# EAGLE schematic DumbBadgeFusion (EAGLE 9.6.2)

## Sheet 1 of 3: Microcontroller
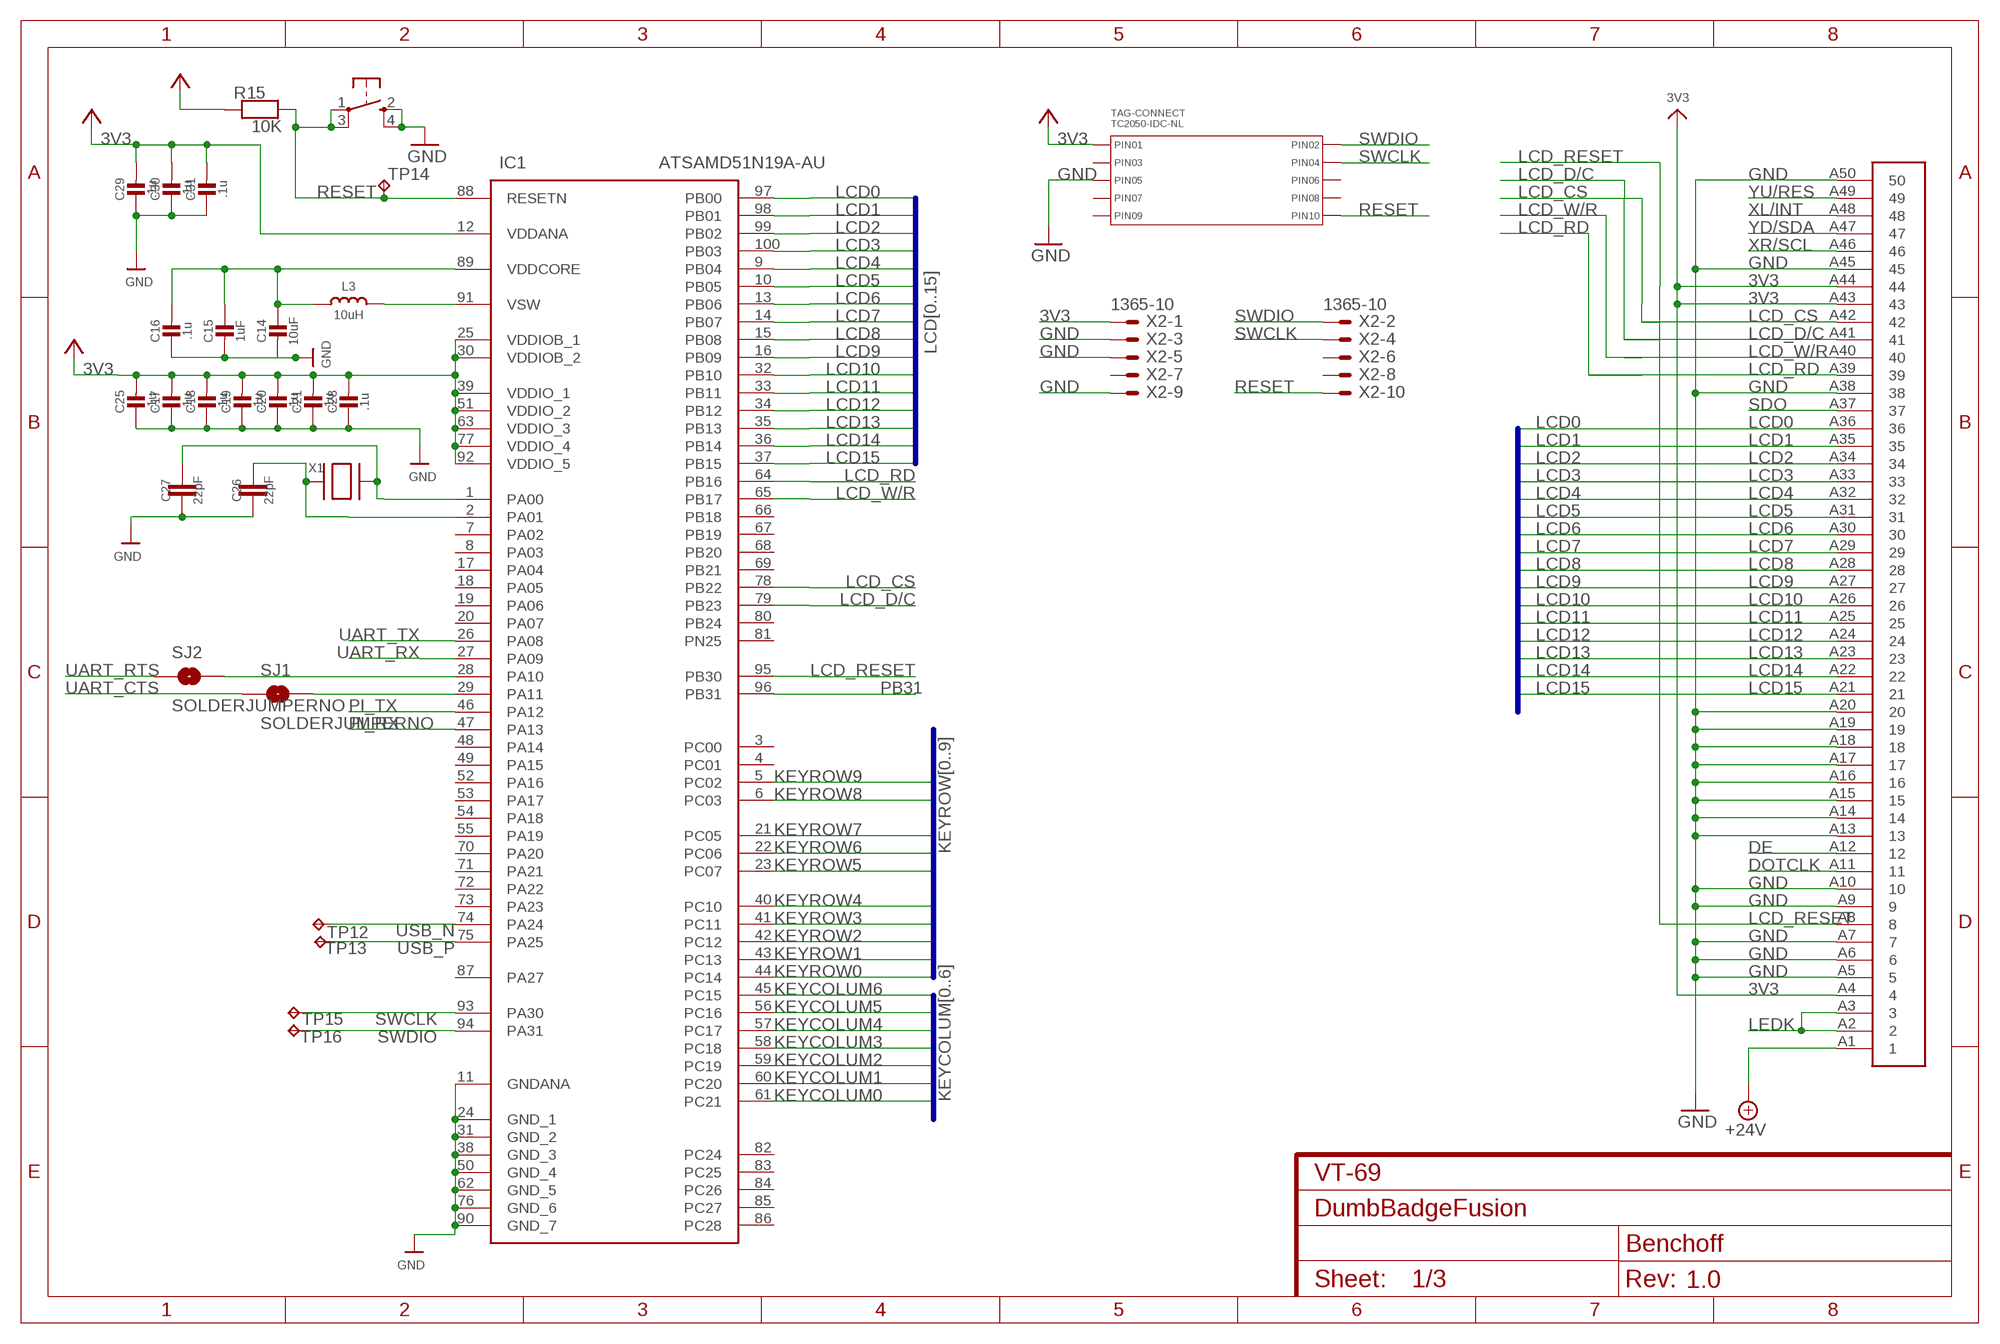
[diagram p0: schematic, sheet 1]
FRAME4 (FRAME-A4L): CNAME: VT-69; CREVISION: 1.0; DESIGNER: Benchoff

### Parts
C14  10uF  CAP_CERAMIC0805-NOOUTLINE  [0805-NO]
C15  1uF  CAP_CERAMIC0603_NO  [0603-NO]
C16  .1u  CAP_CERAMIC0603_NO  [0603-NO]
C17  .1u  CAP_CERAMIC0603_NO  [0603-NO]
C18  .1u  CAP_CERAMIC0603_NO  [0603-NO]
C19  .1u  CAP_CERAMIC0603_NO  [0603-NO]
C20  .1u  CAP_CERAMIC0603_NO  [0603-NO]
C21  .1u  CAP_CERAMIC0603_NO  [0603-NO]
C25  .1u  CAP_CERAMIC0603_NO  [0603-NO]
C26  22pF  1.0UF-0805-25V-10%  [0805]
C27  22pF  1.0UF-0805-25V-10%  [0805]
C28  .1u  CAP_CERAMIC0603_NO  [0603-NO]
C29  .1u  CAP_CERAMIC0603_NO  [0603-NO]
C30  .1u  CAP_CERAMIC0603_NO  [0603-NO]
C31  .1u  CAP_CERAMIC0603_NO  [0603-NO]
FPC50CONN  50PINFPC  [62684-501100ALF]
IC1  ATSAMD51N19A-AU  [QFP50P1600X1600X120-100N]
L3  10uH  INDUCTOR  [INDUCTOR_1007]
R15  10K  RESISTOR_0603_NOOUT  [0603-NO]
SJ1  SOLDERJUMPERNO  [SJ_2S-NO]
SJ2  SOLDERJUMPERNO  [SJ_2S-NO]
SW1  SPST_TACT-KMR2  [KMR2]
TAG-CONNECT  TC2050-IDC-NL  CON_02X05_TC2050-IDC-NL  [TC2050-IDC-NL]
TP12  TPB1,27  [B1,27]
TP13  TPB1,27  [B1,27]
TP14  TPB1,27  [B1,27]
TP15  TPB1,27  [B1,27]
TP16  TPB1,27  [B1,27]
X1  NX3215SA-32.768K-STD-MUA-8  XTAL-3.2X1.5  [XTAL3215]
X2  1365-10  [1365-10]

### Nets
3V3: C17.2 C18.2 C19.2 C20.2 C21.2 C25.2 C28.2 C29.2 C30.2 C31.2 FPC50CONN.A4 FPC50CONN.A43 FPC50CONN.A44 IC1.12(VDDANA) IC1.25(VDDIOB_1) IC1.30(VDDIOB_2) IC1.39(VDDIO_1) IC1.51(VDDIO_2) IC1.63(VDDIO_3) IC1.77(VDDIO_4) IC1.92(VDDIO_5) R15.1 TAG-CONNECT.P$1(PIN1) X2.1 ; supply symbol labelled +3V3 ; also sheet 2,3
+24V: FPC50CONN.A1 ; also sheet 2
DE: FPC50CONN.A12
DOTCLK: FPC50CONN.A11
GND: C14.2 C15.2 C16.1 C17.1 C18.1 C19.1 C20.1 C21.1 C25.1 C26.1 C27.1 C28.1 C29.1 C30.1 C31.1 FPC50CONN.A5 FPC50CONN.A6 FPC50CONN.A7 FPC50CONN.A9 FPC50CONN.A10 FPC50CONN.A13 FPC50CONN.A14 FPC50CONN.A15 FPC50CONN.A16 FPC50CONN.A17 FPC50CONN.A18 FPC50CONN.A19 FPC50CONN.A20 FPC50CONN.A38 FPC50CONN.A45 FPC50CONN.A50 IC1.11(GNDANA) IC1.24(GND_1) IC1.31(GND_2) IC1.38(GND_3) IC1.50(GND_4) IC1.62(GND_5) IC1.76(GND_6) IC1.90(GND_7) SW1.2(S) SW1.4(S1) TAG-CONNECT.P$5(PIN5) X2.3 X2.5 X2.9 ; also sheet 2,3
KEYCOLUM0: IC1.61(PC21) ; also sheet 3
KEYCOLUM1: IC1.60(PC20) ; also sheet 3
KEYCOLUM2: IC1.59(PC19) ; also sheet 3
KEYCOLUM3: IC1.58(PC18) ; also sheet 3
KEYCOLUM4: IC1.57(PC17) ; also sheet 3
KEYCOLUM5: IC1.56(PC16) ; also sheet 3
KEYCOLUM6: IC1.45(PC15) ; also sheet 3
KEYROW0: IC1.44(PC14) ; also sheet 3
KEYROW1: IC1.43(PC13) ; also sheet 3
KEYROW2: IC1.42(PC12) ; also sheet 3
KEYROW3: IC1.41(PC11) ; also sheet 3
KEYROW4: IC1.40(PC10) ; also sheet 3
KEYROW5: IC1.23(PC07) ; also sheet 3
KEYROW6: IC1.22(PC06) ; also sheet 3
KEYROW7: IC1.21(PC05) ; also sheet 3
KEYROW8: IC1.6(PC03) ; also sheet 3
KEYROW9: IC1.5(PC02) ; also sheet 3
LCD0: FPC50CONN.A36 IC1.97(PB00)
LCD1: FPC50CONN.A35 IC1.98(PB01)
LCD2: FPC50CONN.A34 IC1.99(PB02)
LCD3: FPC50CONN.A33 IC1.100(PB03)
LCD4: FPC50CONN.A32 IC1.9(PB04)
LCD5: FPC50CONN.A31 IC1.10(PB05)
LCD6: FPC50CONN.A30 IC1.13(PB06)
LCD7: FPC50CONN.A29 IC1.14(PB07)
LCD8: FPC50CONN.A28 IC1.15(PB08)
LCD9: FPC50CONN.A27 IC1.16(PB09)
LCD10: FPC50CONN.A26 IC1.32(PB10)
LCD11: FPC50CONN.A25 IC1.33(PB11)
LCD12: FPC50CONN.A24 IC1.34(PB12)
LCD13: FPC50CONN.A23 IC1.35(PB13)
LCD14: FPC50CONN.A22 IC1.36(PB14)
LCD15: FPC50CONN.A21 IC1.37(PB15)
LCD_CS: FPC50CONN.A42 IC1.78(PB22)
LCD_D/C: FPC50CONN.A41 IC1.79(PB23)
LCD_RD: FPC50CONN.A39 IC1.64(PB16)
LCD_RESET: FPC50CONN.A8 IC1.95(PB30)
LCD_W/R: FPC50CONN.A40 IC1.65(PB17)
LEDK: FPC50CONN.A2 FPC50CONN.A3 ; also sheet 2
N$23: IC1.28(PA10) SJ2.2
N$26: C14.1 C15.1 C16.2 IC1.89(VDDCORE) L3.P$1
N$27: IC1.91(VSW) L3.P$2
N$28: IC1.29(PA11) SJ1.2
N$54: C27.2 IC1.1(PA00) X1.P$1
N$55: C26.2 IC1.2(PA01) X1.P$2
PB31: IC1.96(PB31) ; also sheet 3
PI_RX: IC1.47(PA13) ; also sheet 3
PI_TX: IC1.46(PA12) ; also sheet 3
RESET: IC1.88(RESETN) R15.2 SW1.1(P) SW1.3(P1) TAG-CONNECT.P$10(PIN10) TP14.TP X2.10
SDO: FPC50CONN.A37
SWCLK: IC1.93(PA30) TAG-CONNECT.P$4(PIN4) TP15.TP X2.4
SWDIO: IC1.94(PA31) TAG-CONNECT.P$2(PIN2) TP16.TP X2.2
UART_CTS: SJ1.1 ; also sheet 3
UART_RTS: SJ2.1 ; also sheet 3
UART_RX: IC1.27(PA09) ; also sheet 3
UART_TX: IC1.26(PA08) ; also sheet 3
USB_N: IC1.74(PA24) TP12.TP ; also sheet 2
USB_P: IC1.75(PA25) TP13.TP ; also sheet 2
XL/INT: FPC50CONN.A48
XR/SCL: FPC50CONN.A46
YD/SDA: FPC50CONN.A47
YU/RES: FPC50CONN.A49
Unconnected: IC1.3(PC00) IC1.4(PC01) IC1.7(PA02) IC1.8(PA03) IC1.17(PA04) IC1.18(PA05) IC1.19(PA06) IC1.20(PA07) IC1.48(PA14) IC1.49(PA15) IC1.52(PA16) IC1.53(PA17) IC1.54(PA18) IC1.55(PA19) IC1.66(PB18) IC1.67(PB19) IC1.68(PB20) IC1.69(PB21) IC1.70(PA20) IC1.71(PA21) IC1.72(PA22) IC1.73(PA23) IC1.80(PB24) IC1.81(PN25) IC1.82(PC24) IC1.83(PC25) IC1.84(PC26) IC1.85(PC27) IC1.86(PC28) IC1.87(PA27) TAG-CONNECT.P$3(PIN3) TAG-CONNECT.P$6(PIN6) TAG-CONNECT.P$7(PIN7) TAG-CONNECT.P$8(PIN8) TAG-CONNECT.P$9(PIN9) X2.6 X2.7 X2.8

### Buses
LCD[0..15]
KEYCOLUM[0..6]
KEYROW[0..9]

## Sheet 2 of 3: Power System I
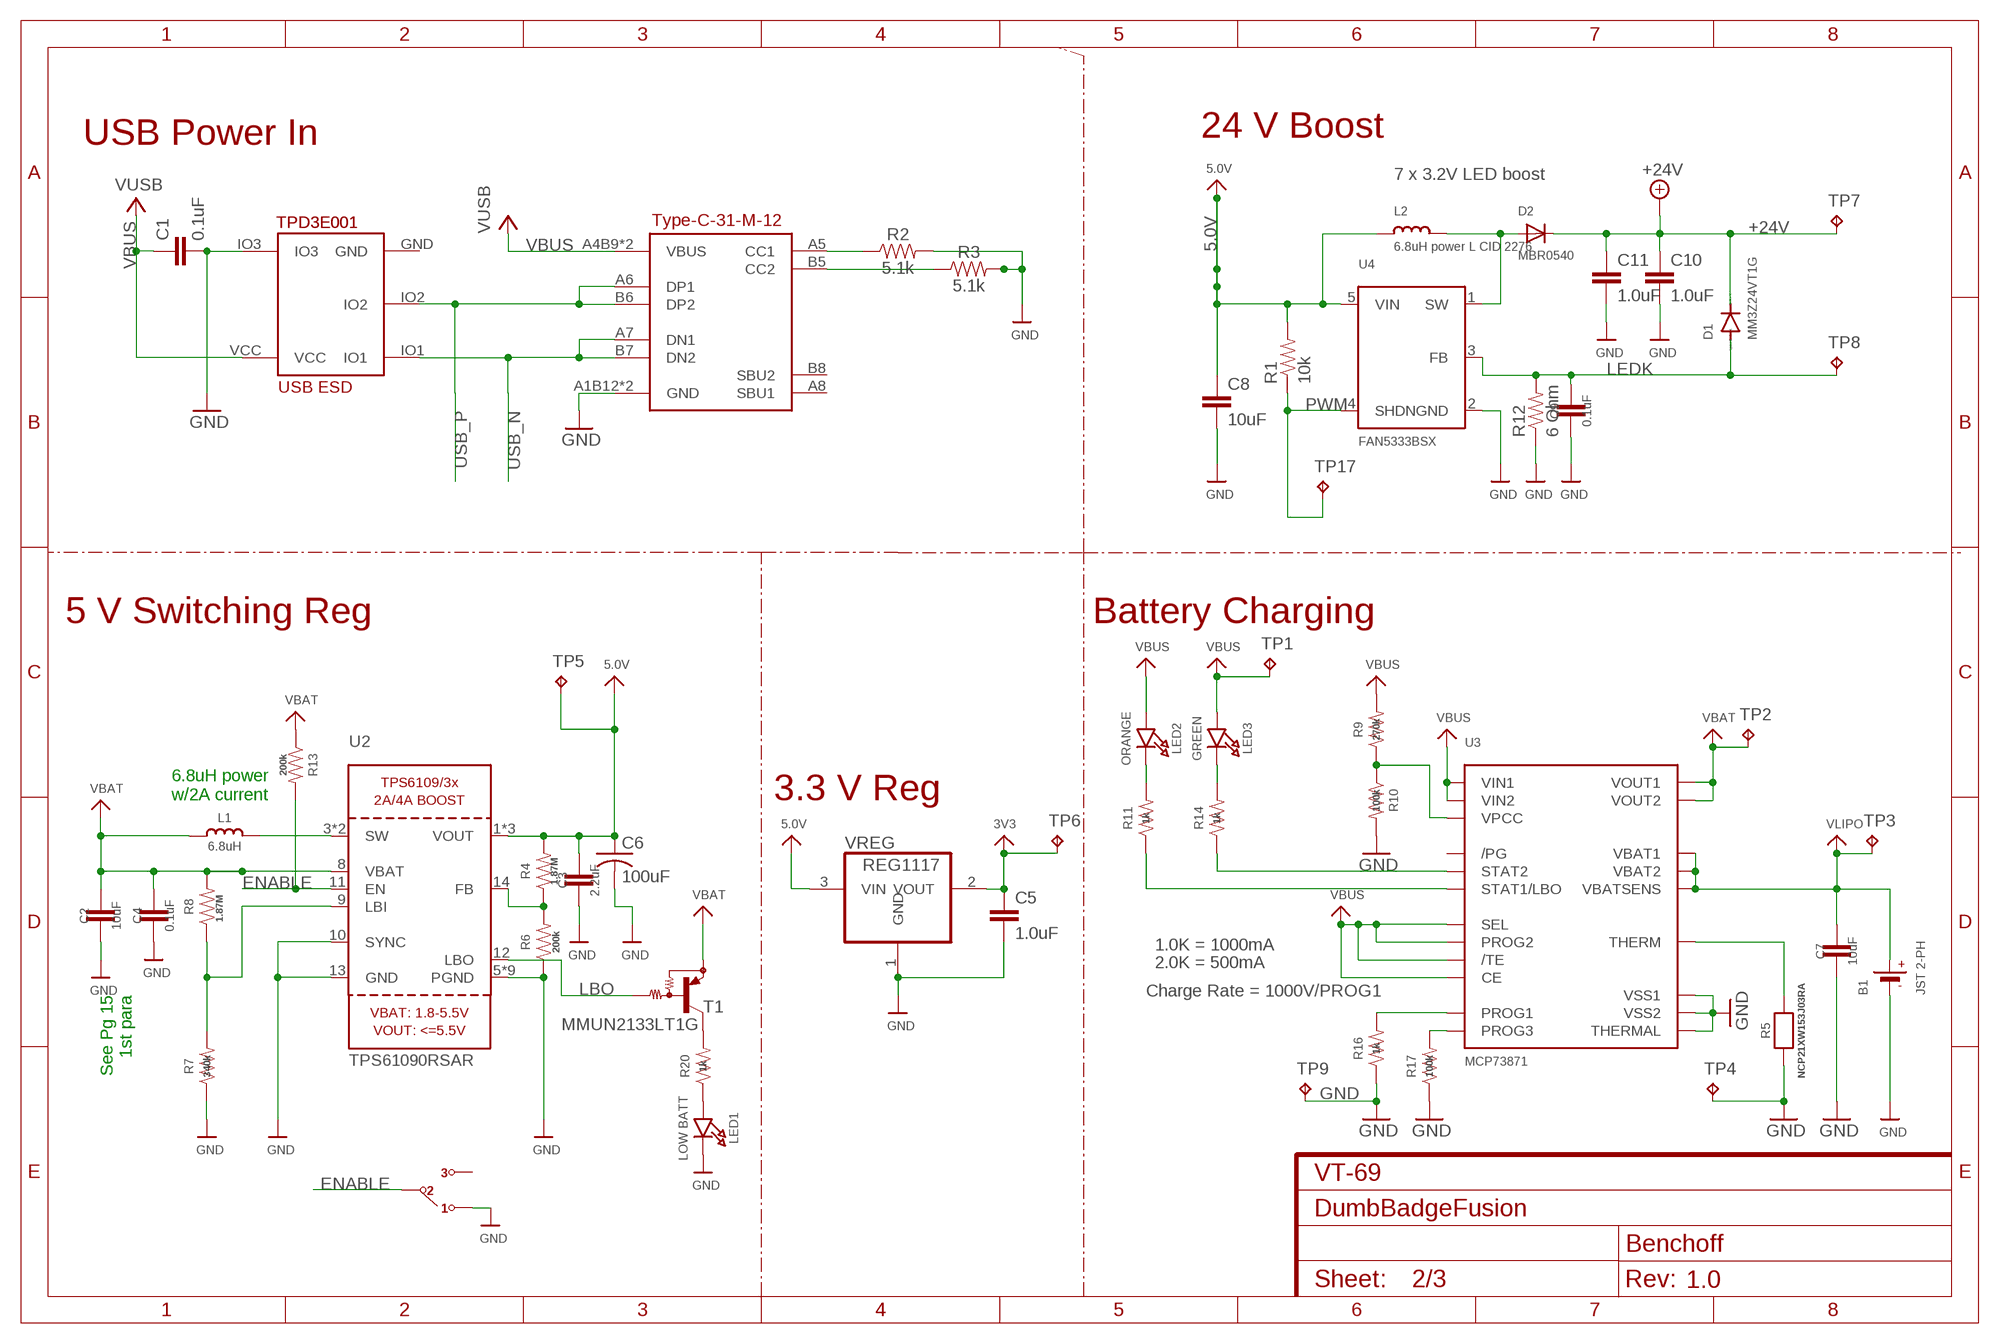
[diagram p1: schematic, sheet 2]
FRAME1 (FRAME-A4L): CNAME: VT-69; CREVISION: 1.0; DESIGNER: Benchoff

### Parts
B1  JST 2-PH  BATTERY  [JSTPH2]
C1  0.1uF  1.0UF-0805-25V-10%  [0805]
C2  10uF  1.0UF-0805-25V-10%  [0805]
C3  2.2uF  1.0UF-0805-25V-10%  [0805]
C4  0.1uF  1.0UF-0805-25V-10%  [0805]
C5  1.0uF  1.0UF-0805-25V-10%  [0805]
C6  100uF  C-USC1210  [C1210]
C7  10uF  1.0UF-0805-25V-10%  [0805]
C8  10uF  1.0UF-0805-25V-10%  [0805]
C9  0.1uF  1.0UF-0805-25V-10%  [0805]
C10  1.0uF  1.0UF-0805-25V-10%  [0805]
C11  1.0uF  1.0UF-0805-25V-10%  [0805]
D1  MM3Z24VT1G  DIODE-SOD323-W  [SOD323-W]
D2  MBR0540  DIODESOD-123  [SOD-123]
L1  6.8uH  INDUCTORTDK_VLC5045  [INDUCTOR_5X5MM_TDK_VLC5045]
L2  6.8uH power L CID 2276  INDUCTORNR5040  [INDUCTOR_5X5MM_NR5040_NOTHERMALS]
LED1  LOW BATT  LED0805_NOOUTLINE  [CHIPLED_0805_NOOUTLINE]
LED2  ORANGE  LED0805_NOOUTLINE  [CHIPLED_0805_NOOUTLINE]
LED3  GREEN  LED0805_NOOUTLINE  [CHIPLED_0805_NOOUTLINE]
R1  10k  1KOHM-0603-1/10W-1%  [0603]
R2  5.1k  1KOHM-0603-1/10W-1%  [0603]
R3  5.1k  1KOHM-0603-1/10W-1%  [0603]
R4  1.87M  1KOHM-0603-1/10W-1%  [0603]
R5  NCP21XW153J03RA  RESISTOR0805_NOOUTLINE  [0805-NO]
R6  200k  1KOHM-0603-1/10W-1%  [0603]
R7  340k  1KOHM-0603-1/10W-1%  [0603]
R8  1.87M  1KOHM-0603-1/10W-1%  [0603]
R9  270k  1KOHM-0603-1/10W-1%  [0603]
R10  100k  1KOHM-0603-1/10W-1%  [0603]
R11  1k  1KOHM-0603-1/10W-1%  [0603]
R12  6 Ohm  1KOHM-0603-1/10W-1%  [0603]
R13  200k  1KOHM-0603-1/10W-1%  [0603]
R14  1k  1KOHM-0603-1/10W-1%  [0603]
R16  1k  1KOHM-0603-1/10W-1%  [0603]
R17  100k  1KOHM-0603-1/10W-1%  [0603]
R20  1k  1KOHM-0603-1/10W-1%  [0603]
T1  MMUN2133LT1G  MUN2114T1-PNP_DRIVER-SC59-BEC  [SC59-BEC]
TP1  TPB1,27  [B1,27]
TP2  TPB1,27  [B1,27]
TP3  TPB1,27  [B1,27]
TP4  TPB1,27  [B1,27]
TP5  TPB1,27  [B1,27]
TP6  TPB1,27  [B1,27]
TP7  TPB1,27  [B1,27]
TP8  TPB1,27  [B1,27]
TP9  TPB1,27  [B1,27]
TP17  TPB1,27  [B1,27]
U2  TPS61090RSAR  VREG_TPS6103X  [PVQFN-16]
U3  MCP73871  [QFN20_4MM]
U4  FAN5333BSX  FAN5331  [SOT23-5@1]
U5  TPD3E001SOT5  [SOT(5)]
U$5  OS102011MA1QN1  [OS102011MA1QN1]
USB  TYPE-C-31-M-12  [TYPE-C-31-M-12]
VREG  REG1117  [SOT223]

### Nets
3V3: C5.1 TP6.TP VREG.2(VOUT) ; also sheet 1,3
5.0V: C3.1 C6.1 C8.1 L2.P$1 R1.2 R4.2 TP5.TP U2.1(VOUT) U2.15(VOUT) U2.16(VOUT) U4.5(VIN) VREG.3(VIN) ; also sheet 3
+24V: C10.1 C11.1 D1.C D2.C TP7.TP ; also sheet 1
ENABLE: R13.2 U2.11(EN) U$5.P$2
GND: B1.1(-) C1.2 C2.2 C3.2 C4.2 C5.2 C6.2 C7.2 C8.2 C9.2 C10.2 C11.2 LED1.C R2.2 R3.2 R5.1 R6.1 R7.1 R10.2 R12.1 R16.1 R17.1 TP4.TP TP9.TP U2.5(PGND) U2.6(PGND) U2.7(PGND) U2.10(SYNC) U2.13(GND) U2.P$18(PGND) U2.P$19(PGND) U2.P$20(PGND) U2.P$21(PGND) U2.P$22(PGND) U2.THERMAL(PGND) U3.P$10(VSS1) U3.P$11(VSS2) U3.P$21(THERMAL) U4.2(GND) U5.IO3 U$5.P$1 USB.A1B12(GND) USB.B1A12(GND) VREG.1(GND) ; also sheet 1,3
LBO: T1.B U2.12(LBO)
LEDK: C9.1 D1.A R12.2 TP8.TP U4.3(FB) ; also sheet 1
N$2: L1.P$2 U2.3(SW) U2.4(SW)
N$4: R7.2 R8.1 U2.9(LBI)
N$5: LED1.A R20.1
N$7: R4.1 R6.2 U2.14(FB)
N$8: R20.2 T1.C
N$10: R9.1 R10.1 U3.P$2(VPCC)
N$11: R14.1 U3.P$7(STAT2)
N$13: R11.1 U3.P$8(STAT1/LBO)
N$14: R5.2 U3.P$5(THERM)
N$16: R16.2 U3.P$13(PROG1)
N$17: LED3.C R14.2
N$18: LED2.C R11.2
N$19: R17.2 U3.P$12(PROG3)
N$20: D2.A L2.P$2 U4.1(SW)
N$24: R2.1 USB.A5(CC1)
N$25: R3.1 USB.B5(CC2)
PWM: R1.1 TP17.TP U4.4(SHDN)
USB_N: U5.IO1 USB.A7(DN1) USB.B7(DN2) ; also sheet 1
USB_P: U5.IO2 USB.A6(DP1) USB.B6(DP2) ; also sheet 1
VBAT: C2.1 C4.1 L1.P$1 R8.2 R13.1 T1.E TP2.TP U2.8(VBAT) U3.P$1(VOUT1) U3.P$20(VOUT2)
VBUS: C1.1 LED2.A LED3.A R9.2 TP1.TP U3.P$3(SEL) U3.P$4(PROG2) U3.P$9(/TE) U3.P$17(CE) U3.P$18(VIN1) U3.P$19(VIN2) U5.VCC USB.A4B9(VBUS) USB.B4A9(VBUS) ; supply symbol labelled VUSB
VLIPO: B1.2(+) C7.1 TP3.TP U3.P$14(VBAT1) U3.P$15(VBAT2) U3.P$16(VBATSENS)
Unconnected: U3.P$6(/PG) U5.GND U$5.CASE1(CASE) U$5.CASE2(CASE) U$5.P$3 USB.A8(SBU1) USB.B8(SBU2)

### Notes on the sheet
- USB Power In | 24 V Boost
- 7 x 3.2V LED boost
- Type-C-31-M-12
- 5 V Switching Reg | Battery Charging
- 6.8uH power
  w/2A current
- 3.3 V Reg
- 1.0K = 1000mA
- 2.0K = 500mA
- See Pg 15
  1st para
- Charge Rate = 1000V/PROG1

## Sheet 3 of 3: Keyboard Matrix
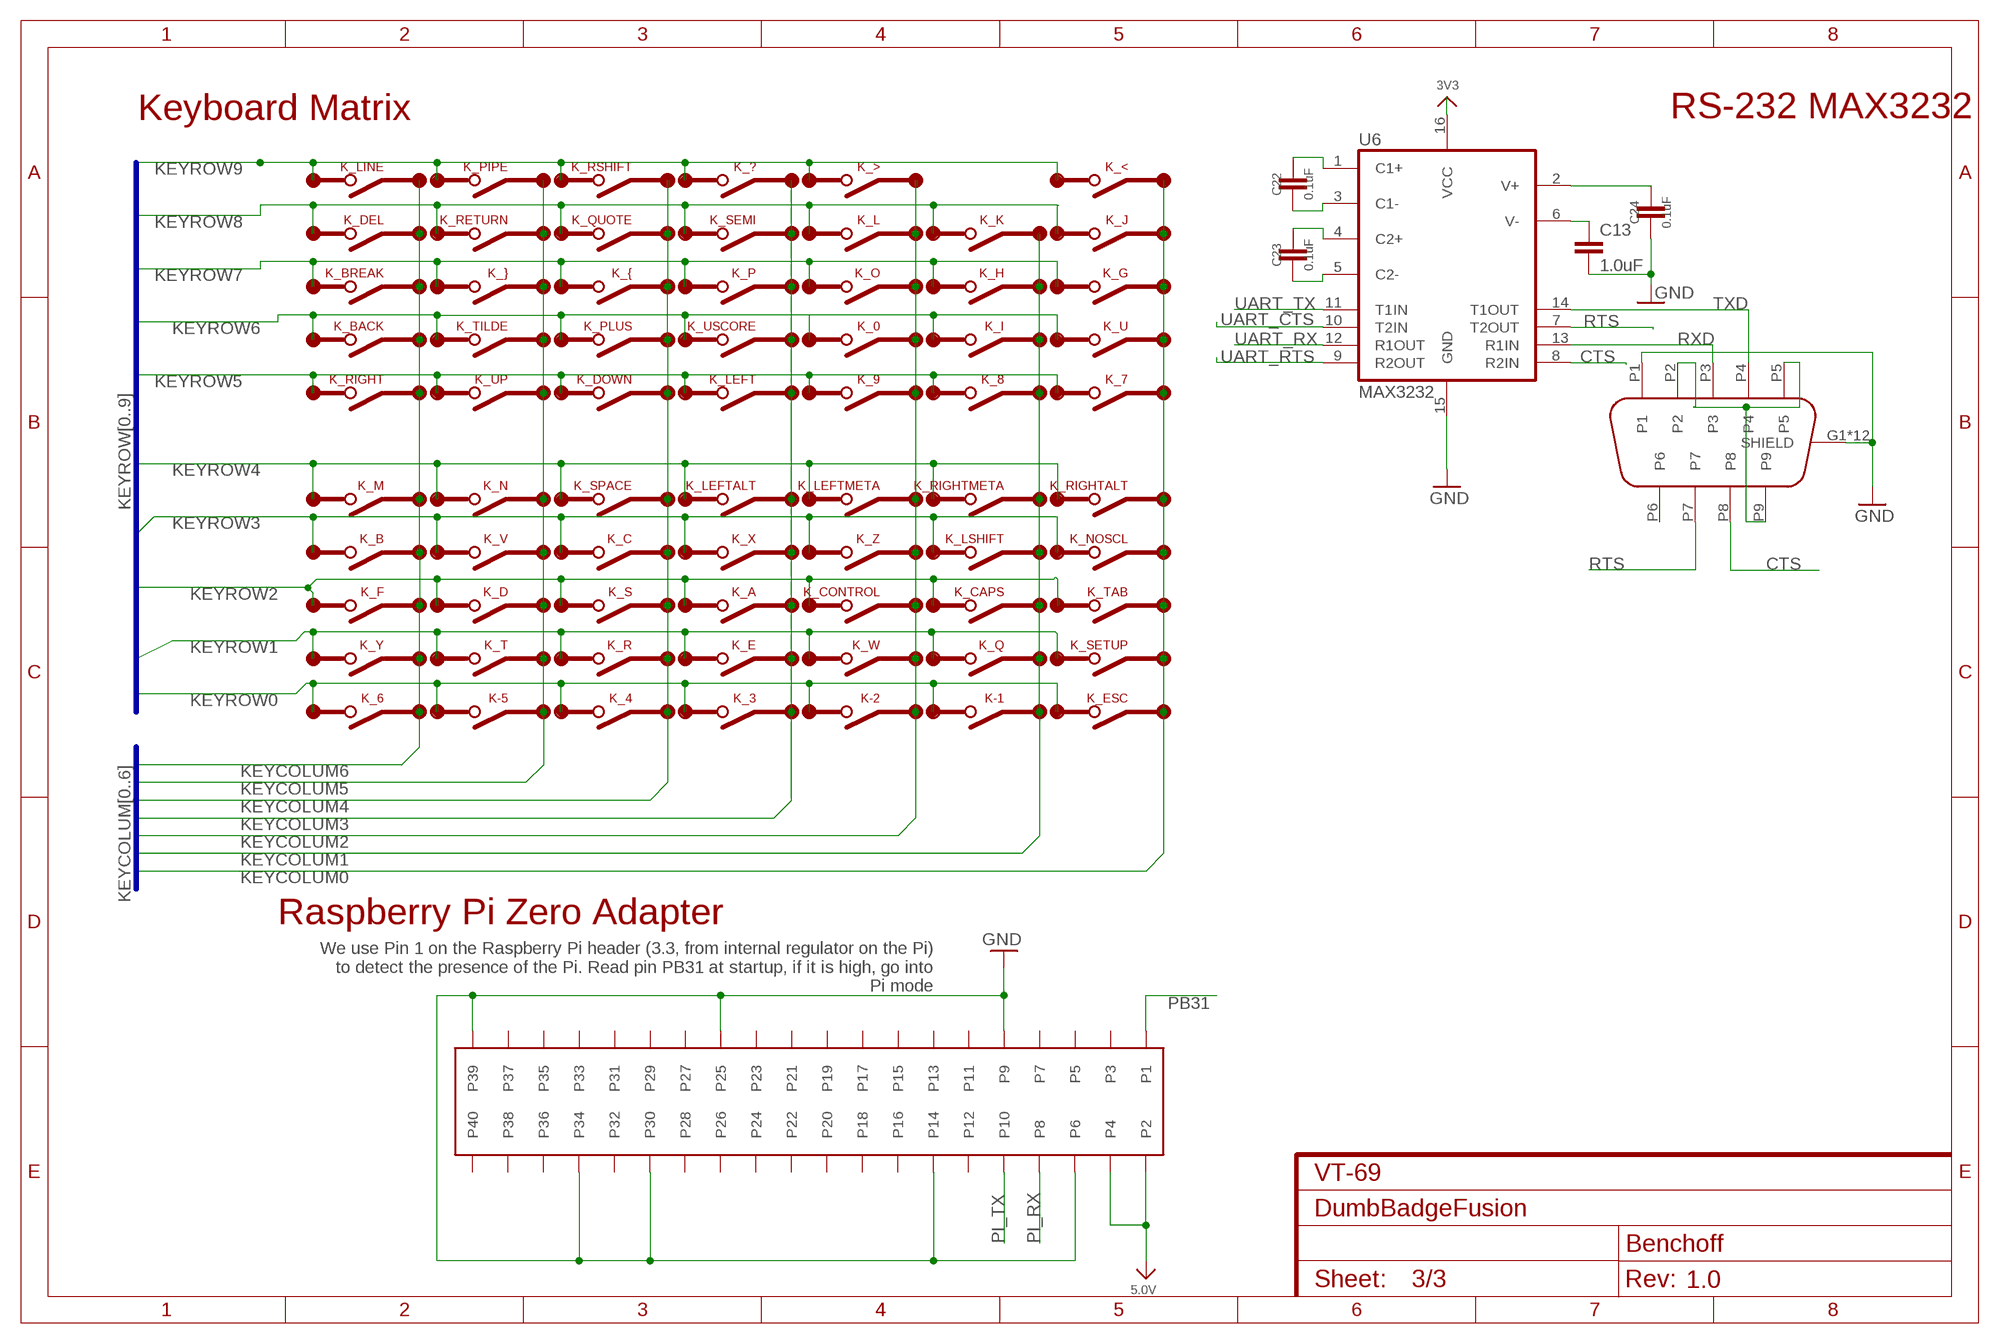
[diagram p2: schematic, sheet 3]
SHEET1 (FRAME-A4L): CNAME: VT-69; CREVISION: 1.0; DESIGNER: Benchoff

### Parts
C13  1.0uF  1.0UF-0805-25V-10%  [0805]
C22  0.1uF  1.0UF-0805-25V-10%  [0805]
C23  0.1uF  1.0UF-0805-25V-10%  [0805]
C24  0.1uF  1.0UF-0805-25V-10%  [0805]
DE9FEMALE  EDGEMOUNTDE9  [DE09S065TLF]
K-1  1U_PAD  [SILICONE_SWITCH]
K-2  1U_PAD  [SILICONE_SWITCH]
K-5  1U_PAD  [SILICONE_SWITCH]
K_0  1U_PAD  [SILICONE_SWITCH]
K_3  1U_PAD  [SILICONE_SWITCH]
K_4  1U_PAD  [SILICONE_SWITCH]
K_6  1U_PAD  [SILICONE_SWITCH]
K_7  1U_PAD  [SILICONE_SWITCH]
K_8  1U_PAD  [SILICONE_SWITCH]
K_9  1U_PAD  [SILICONE_SWITCH]
K_<  1U_PAD  [SILICONE_SWITCH]
K_>  1U_PAD  [SILICONE_SWITCH]
K_?  1U_PAD  [SILICONE_SWITCH]
K_A  1U_PAD  [SILICONE_SWITCH]
K_B  1U_PAD  [SILICONE_SWITCH]
K_BACK  1U_PAD  [SILICONE_SWITCH]
K_BREAK  1U_PAD  [SILICONE_SWITCH]
K_C  1U_PAD  [SILICONE_SWITCH]
K_CAPS  1U_PAD  [SILICONE_SWITCH]
K_CONTROL  2U_PAD  [SILICONE_SWITCH_2U]
K_D  1U_PAD  [SILICONE_SWITCH]
K_DEL  1U_PAD  [SILICONE_SWITCH]
K_DOWN  1U_PAD  [SILICONE_SWITCH]
K_E  1U_PAD  [SILICONE_SWITCH]
K_ESC  1U_PAD  [SILICONE_SWITCH]
K_F  1U_PAD  [SILICONE_SWITCH]
K_G  1U_PAD  [SILICONE_SWITCH]
K_H  1U_PAD  [SILICONE_SWITCH]
K_I  1U_PAD  [SILICONE_SWITCH]
K_J  1U_PAD  [SILICONE_SWITCH]
K_K  1U_PAD  [SILICONE_SWITCH]
K_L  1U_PAD  [SILICONE_SWITCH]
K_LEFT  1U_PAD  [SILICONE_SWITCH]
K_LEFTALT  1U_PAD  [SILICONE_SWITCH]
K_LEFTMETA  1U_PAD  [SILICONE_SWITCH]
K_LINE  1U_PAD  [SILICONE_SWITCH]
K_LSHIFT  2U_PAD  [SILICONE_SWITCH_2U]
K_M  1U_PAD  [SILICONE_SWITCH]
K_N  1U_PAD  [SILICONE_SWITCH]
K_NOSCL  1U_PAD  [SILICONE_SWITCH]
K_O  1U_PAD  [SILICONE_SWITCH]
K_P  1U_PAD  [SILICONE_SWITCH]
K_PIPE  1U_PAD  [SILICONE_SWITCH]
K_PLUS  1U_PAD  [SILICONE_SWITCH]
K_Q  1U_PAD  [SILICONE_SWITCH]
K_QUOTE  1U_PAD  [SILICONE_SWITCH]
K_R  1U_PAD  [SILICONE_SWITCH]
K_RETURN  RETURN_PAD  [SILICONE_RETURN]
K_RIGHT  1U_PAD  [SILICONE_SWITCH]
K_RIGHTALT  1U_PAD  [SILICONE_SWITCH]
K_RIGHTMETA  1U_PAD  [SILICONE_SWITCH]
K_RSHIFT  2U_PAD  [SILICONE_SWITCH_2U]
K_S  1U_PAD  [SILICONE_SWITCH]
K_SEMI  1U_PAD  [SILICONE_SWITCH]
K_SETUP  2U_PAD  [SILICONE_SWITCH_2U]
K_SPACE  SPACE_PAD  [SILICONE_SPACE]
K_T  1U_PAD  [SILICONE_SWITCH]
K_TAB  1U_PAD  [SILICONE_SWITCH]
K_TILDE  1U_PAD  [SILICONE_SWITCH]
K_U  1U_PAD  [SILICONE_SWITCH]
K_UP  1U_PAD  [SILICONE_SWITCH]
K_USCORE  1U_PAD  [SILICONE_SWITCH]
K_V  1U_PAD  [SILICONE_SWITCH]
K_W  1U_PAD  [SILICONE_SWITCH]
K_X  1U_PAD  [SILICONE_SWITCH]
K_Y  1U_PAD  [SILICONE_SWITCH]
K_Z  1U_PAD  [SILICONE_SWITCH]
K_{  1U_PAD  [SILICONE_SWITCH]
K_}  1U_PAD  [SILICONE_SWITCH]
U6  MAX3232  MAX2323SOIC16  [SO16]
U$30  SAMTEC_PI_REVERSE  [HLE-120-02-G-DV-BE-A--REVERSEMOUNT]

### Nets
3V3: U6.16(VCC) ; also sheet 1,2
5.0V: U$30.P2 U$30.P4 ; also sheet 2
CTS: DE9FEMALE.P8 U6.8(R2IN)
GND: C13.2 C24.2 DE9FEMALE.G1(SHIELD) DE9FEMALE.G2(SHIELD) DE9FEMALE.G3(SHIELD) DE9FEMALE.G4(SHIELD) DE9FEMALE.G5(SHIELD) DE9FEMALE.G6(SHIELD) DE9FEMALE.G7(SHIELD) DE9FEMALE.G8(SHIELD) DE9FEMALE.G9(SHIELD) DE9FEMALE.G10(SHIELD) DE9FEMALE.G11(SHIELD) DE9FEMALE.G12(SHIELD) DE9FEMALE.P1 U6.15(GND) U$30.P6 U$30.P9 U$30.P14 U$30.P25 U$30.P30 U$30.P34 U$30.P39 ; also sheet 1,2
KEYCOLUM0: K_7.P$2 K_<.P$2 K_ESC.P$2 K_G.P$2 K_J.P$2 K_NOSCL.P$2 K_RIGHTALT.P$2 K_SETUP.P$2 K_TAB.P$2 K_U.P$2 ; also sheet 1
KEYCOLUM1: K-1.P$2 K_8.P$2 K_CAPS.P$2 K_H.P$2 K_I.P$2 K_K.P$2 K_LSHIFT.P$2 K_Q.P$2 K_RIGHTMETA.P$2 ; also sheet 1
KEYCOLUM2: K-2.P$2 K_0.P$2 K_9.P$2 K_>.P$2 K_CONTROL.P$2 K_L.P$2 K_LEFTMETA.P$2 K_O.P$2 K_W.P$2 K_Z.P$2 ; also sheet 1
KEYCOLUM3: K_3.P$2 K_?.P$2 K_A.P$2 K_E.P$2 K_LEFT.P$2 K_LEFTALT.P$2 K_P.P$2 K_SEMI.P$2 K_USCORE.P$2 K_X.P$2 ; also sheet 1
KEYCOLUM4: K_4.P$2 K_C.P$2 K_DOWN.P$2 K_PLUS.P$2 K_QUOTE.P$2 K_R.P$2 K_RSHIFT.P$2 K_S.P$2 K_SPACE.P$2 K_{.P$2 ; also sheet 1
KEYCOLUM5: K-5.P$2 K_D.P$2 K_N.P$2 K_PIPE.P$2 K_RETURN.P$2 K_T.P$2 K_TILDE.P$2 K_UP.P$2 K_V.P$2 K_}.P$2 ; also sheet 1
KEYCOLUM6: K_6.P$2 K_B.P$2 K_BACK.P$2 K_BREAK.P$2 K_DEL.P$2 K_F.P$2 K_LINE.P$2 K_M.P$2 K_RIGHT.P$2 K_Y.P$2 ; also sheet 1
KEYROW0: K-1.P$1 K-2.P$1 K-5.P$1 K_3.P$1 K_4.P$1 K_6.P$1 K_ESC.P$1 ; also sheet 1
KEYROW1: K_E.P$1 K_Q.P$1 K_R.P$1 K_SETUP.P$1 K_T.P$1 K_W.P$1 K_Y.P$1 ; also sheet 1
KEYROW2: K_A.P$1 K_CAPS.P$1 K_CONTROL.P$1 K_D.P$1 K_F.P$1 K_S.P$1 K_TAB.P$1 ; also sheet 1
KEYROW3: K_B.P$1 K_C.P$1 K_LSHIFT.P$1 K_NOSCL.P$1 K_V.P$1 K_X.P$1 K_Z.P$1 ; also sheet 1
KEYROW4: K_LEFTALT.P$1 K_LEFTMETA.P$1 K_M.P$1 K_N.P$1 K_RIGHTALT.P$1 K_RIGHTMETA.P$1 K_SPACE.P$1 ; also sheet 1
KEYROW5: K_7.P$1 K_8.P$1 K_9.P$1 K_DOWN.P$1 K_LEFT.P$1 K_RIGHT.P$1 K_UP.P$1 ; also sheet 1
KEYROW6: K_0.P$1 K_BACK.P$1 K_I.P$1 K_PLUS.P$1 K_TILDE.P$1 K_U.P$1 K_USCORE.P$1 ; also sheet 1
KEYROW7: K_BREAK.P$1 K_G.P$1 K_H.P$1 K_O.P$1 K_P.P$1 K_{.P$1 K_}.P$1 ; also sheet 1
KEYROW8: K_DEL.P$1 K_J.P$1 K_K.P$1 K_L.P$1 K_QUOTE.P$1 K_RETURN.P$1 K_SEMI.P$1 ; also sheet 1
KEYROW9: K_<.P$1 K_>.P$1 K_?.P$1 K_LINE.P$1 K_PIPE.P$1 K_RSHIFT.P$1 ; also sheet 1
N$1: C24.1 U6.2(V+)
N$6: C22.2 U6.3(C1-)
N$9: C22.1 U6.1(C1+)
N$12: C23.1 U6.4(C2+)
N$15: C23.2 U6.5(C2-)
N$21: C13.1 U6.6(V-)
N$22: DE9FEMALE.P2 DE9FEMALE.P5 DE9FEMALE.P9
PB31: U$30.P1 ; also sheet 1
PI_RX: U$30.P8 ; also sheet 1
PI_TX: U$30.P10 ; also sheet 1
RTS: DE9FEMALE.P7 U6.7(T2OUT)
RXD: DE9FEMALE.P3 U6.13(R1IN)
TXD: DE9FEMALE.P4 U6.14(T1OUT)
UART_CTS: U6.10(T2IN) ; also sheet 1
UART_RTS: U6.9(R2OUT) ; also sheet 1
UART_RX: U6.12(R1OUT) ; also sheet 1
UART_TX: U6.11(T1IN) ; also sheet 1
Unconnected: DE9FEMALE.P6 U$30.P3 U$30.P5 U$30.P7 U$30.P11 U$30.P12 U$30.P13 U$30.P15 U$30.P16 U$30.P17 U$30.P18 U$30.P19 U$30.P20 U$30.P21 U$30.P22 U$30.P23 U$30.P24 U$30.P26 U$30.P27 U$30.P28 U$30.P29 U$30.P31 U$30.P32 U$30.P33 U$30.P35 U$30.P36 U$30.P37 U$30.P38 U$30.P40

### Buses
KEYCOLUM[0..6]
KEYROW[0..9]

### Notes on the sheet
- Keyboard Matrix | RS-232 MAX3232
- Raspberry Pi Zero Adapter
- We use Pin 1 on the Raspberry Pi header (3.3, from internal regulator on the Pi)
  to detect the presence of the Pi. Read pin PB31 at startup, if it is high, go into
  Pi mode

## Library data of the parts
B1 = microbuilder:BATTERY: CR1220 SMT - Digikey: 3001K-ND CD2032 BAT-HLD-001 - Digikey: BAT-HLD-001-ND
C1-C4 C7-C9 C22-C24 C26 C27 = SparkFun-Capacitors:1.0UF: 1µF ceramic capacitors A capacitor is a passive two-terminal electrical component used to store electrical energy temporarily in an electric field.; PROD_ID: CAP-08064; VALUE: 1.0uF
C5 C10 C11 C13 = SparkFun-Capacitors:1.0UF: 1µF ceramic capacitors A capacitor is a passive two-terminal electrical component used to store electrical energy temporarily in an electric field.; PROD_ID: CAP-08064
C6 = rcl:C-US: CAPACITOR, American symbol; SPICEPREFIX: C
C14-C21 C25 C28-C31 = microbuilder:CAP_CERAMIC: Ceramic Capacitors For new designs, use the packages preceded by an '_' character since they are more reliable: The following footprints should be used on most boards: _0402 - Standard footprint for regular board layouts _0603 - Standard footprint for regular board layouts _0805 - Standard footprint for regular board layouts _1206 - Standard footprint for regular board layouts For extremely tight-pitch boards where space is at a premium, the following 'micro-pitch' footprints can be used (smaller pads, no silkscreen outline, etc.): _0402MP - Micro-pitch footprint for very dense/compact boards _0603MP - Micro-pitch footprint for very dense/compact boards _0805MP - Micro-pitch footprint for very dense/compact boards _1206MP - Micro-pitch footprint for very dense/compact boards
D1 = diode:DIODE-: DIODE
D2 = microbuilder:DIODE: Diode SMA Model Volts Amps Type Vf Vr Digikey # Notes SSA34-E3 40V 3A Schottky 480mV @ 3A 200uA @ 40V SSA34-E3/61TGITR-ND CDBA120-G 20V 1A Schottky 500mV @ 1A 500uA @ 20V 641-1014-6-ND REEL MBRA210 10V 2A Schottky 350mV @ 2A 700uA @ 10V MBRA210LT3 SOD-123 Model Volts Amps Type Vf Vr Order # Notes BAT54T1G 30V 200mA Schottky 800mV @ 200mA 2uA @ 25V BAT54T1GOSTR-ND B0530W 30V 500mA Schottky 430mV @ 500mA 130uA @ 30V B0530W-FDICT-ND REEL MBR120 20V 1A Schottky 340mV @ 1A MBR120VLSFT1GOSCT-ND SOD-323 Model Volts Amps Type Vf Vr Order # Notes PMEG2005EJ 20V 500mA Schottky 355mV @ 500mA 568-4110-1-ND ZLLS410 10V 570mA Schottky 380mV @ 570mA ZLLS410CT-ND 1N4148WS 75V 150mA Silicon/Simple 1V 1N4148WSFSCT-ND REEL SOD-523 Model Volts Amps Type Vf Vr Order # Notes BAT54XV2 30V 200mA Schottky 0.8V @ 100mA BAT54XV2CT-ND TB751S 30V 30mA Schottky RB751S-40TE61CT-ND SOT23-R/W (R = Solder Paste/Reflow Ovens, W = Hand-Soldering) Model Volts Amps Type Vf Vr Order # Notes BAT54FILM 40V 300mA Schottky 497-7162-1-ND
DE9FEMALE = Serial:EDGEMOUNTDE9
FPC50CONN = FPC:50PINFPC
IC1 = SamacSys_Parts:ATSAMD51N19A-AU: ARM Microcontrollers - MCU 120MHZ 512KB FLASH 1 00 TQFP PKG 85C Source: Datasheet <http://www.microchip.com/mymicrochip/filehandler.aspx?ddocname=en599585>; DESCRIPTION: ARM Microcontrollers - MCU 120MHZ 512KB FLASH 1 00 TQFP PKG 85C; HEIGHT: 1.2mm; MANUFACTURER_NAME: Microchip; MANUFACTURER_PART_NUMBER: ATSAMD51N19A-AU; MOUSER_PART_NUMBER: 556-ATSAMD51N19AAU; MOUSER_PRICE-STOCK: https://www.mouser.co.uk/ProductDetail/Microchip-Technology-Atmel/ATSAMD51N19A-AU?qs=HXFqYaX1Q2xcdk4pqJrDrA%3D%3D
K-1 K-2 K-5 K_0 K_3 K_4 K_6-K_9 K_< K_> K_? K_A K_B K_BACK K_BREAK K_C K_CAPS K_D K_DEL K_DOWN K_E K_ESC K_F K_G K_H K_I K_J K_K K_L K_LEFT K_LEFTALT K_LEFTMETA K_LINE K_M K_N K_NOSCL K_O K_P K_PIPE K_PLUS K_Q K_QUOTE K_R K_RIGHT K_RIGHTALT K_RIGHTMETA K_S K_SEMI K_T K_TAB K_TILDE K_U K_UP K_USCORE K_V K_W K_X K_Y K_Z K_{ K_} = SiliconeSwitches:1U_PAD
K_CONTROL K_LSHIFT K_RSHIFT K_SETUP = SiliconeSwitches:2U_PAD
K_RETURN = SiliconeSwitches:RETURN_PAD
K_SPACE = SiliconeSwitches:SPACE_PAD
L1-L3 = microbuilder:INDUCTOR: Inductors 0603: 10nH Ceramic Inductor - microwire antenna/RF (Digikey: 712-1434-2-ND) 0805: 560nH Ceramic Inductor - RF (Digikey: 553-1047-1-ND) 270nH Ceramic Inductor - Q = 40@250MHz, +-5%, 1 Ohm DC Resistance (Digikey: 535-10506-2-ND) 1007 (2518 Metric) SMT: 10µH 10% 250mOhm 820mA 1007 Inductor (Digikey: 587-2189-1-ND) 22µH 10% 500mOhm 580mA 1007 Inductor (Digikey: 587-2190-1-ND) 47µH 10% 950mOhm 420mA 1007 Inductor (Digikey: 587-2191-1-ND) 47µH 5% 100mOhm 1A 1008 Inductor (Digikey: 732-1816-1-ND) 5.0x5.0mm (Taiyo Yuden NR5040 Series) 6.8µH 20% 2.3A 64mOhm Inductor (Digikey: 587-2374-2-ND) 5.0x5.0mm (TDK VLC5045 Series) 4.7µH 20% 3.3A 34mOhm Inductor (Digikey: 445-6526-1-ND) 6.8µH 20% 2.7A 46mOhm Inductor (Digikey: 445-6527-1-ND) 6.0x6.0mm (TDK VLC6045 Series) 4.7µH 20% 3.8A 27mOhm Inductor (Digikey: 445-6538-2-ND) 6.8µH 20% 3A 41mOhm Inductor (Digikey: 445-6540-1-ND) 6.2µH 30% 2.2A 45mOhm Inductor (Digikey: SRR5028-6R2YCT-ND) - Not TDK VLC6045 but footprint should match 6.0x6.0mm (TDK SLF6045 Series) 6.8uH 30% 2A 33mOhm Inductor (Digikey: 445-4572-1-ND, Mouser: 810-SLF645T6R8N2R0PF) 6.0x6.0mm (Sumida CDRH5D28 Series) 6.2uH 30% 1.8A 45mOhm Inductor (Digikey: 308-1542-1-ND) Taiyo Yuden NR3015T2R2M - 2.2uH 20% 1.5A (Digikey: 587-1648-2-ND, Mouser: 963-NR3015T2R2M) - Used with TI TPS62172 CoilCraft RFID Transponder Coil - MA5532-AE (For use with AS3935 Lightning Sensor) Taiyo Yuden NRH2412T2R2MNGH - 2.2uH 20% 1AA (Digikey: 587-3443-1-ND) - Used with TI LM3671 Vishay IHLP 1.0uH Molded Inductor - 24mOhm DCR, 5A, +/-20%, -55°C-125°C (Digikey: 541-1319-1-ND)
LED1-LED3 = microbuilder:LED: LED 0603 - 0603 Surface Mount Package 2mA: Green LED - Low Power (3.9mcd, 2ma, 1.7Vf) - Digikey: 475-2709-2-ND Orange LED - Low Power (9.8mcd, 2ma, 1.8Vf) - Digikey: 475-1194-2-ND Red LED - Low Power (5mcd, 2ma, 1.8Vf) - Digikey: 475-1195-2-ND Yellow LED - Low Power (7mcd, 2ma, 1.8Vf) - Digikey: 475-1196-2-ND 5mA: Blue LED - Low Power (17mcd, 5ma, 2.9Vf) - Digikey: LNJ937W8CRACT-ND 0805 - 0805 Surface Mount Package 2mA: Red LED (8.8mcd, 2mA, 1.8Vf, Clear) - Low Power [Digikey: 475-2510-1-ND] Green LED (5mcd, 2mA, 1.8Vf, Clear) - Low Power [Digikey: 475-2730-1-ND] Yellow LED (11.3mcd, 2mA, 1.8Vf, Clear) - Low Power [Digikey: 475-2555-1-ND] 20mA: Red LED (104mcd, 20mA, Diffused) - LS R976 [Digikey: 475-1278-6-ND] Red LED (12mcd, 20mA, 2.0Vf, Clear) - APT2012EC [Digikey: 754-1128-1-ND] Green LED (15mcd, 20mA, 2.2Vf, Clear) - APT2012GC [Digikey: 754-1131-1-ND] Orange LED (160mcd, 20mA, 2.1Vf, Clear) - APT2012SECK [Digikey: 754-1130-1-ND] 1206 - 1206 Surface Mount Package Green LED (26mcd, 20mA, Diffused) - LG N971 [Digikey: 475-1407-6-ND] Red LED (15mcd, 20mA, Diffused) - LH N974 [Digikey: 475-1416-6-ND] Cree - Cree High-Power Surface Mount LEDs XPEBWT-L1-0000-00D50 - White 111lm 350mA 2.9Vf 6200K 110° XTEAWT-00-0000-00000LEE3 - White 114lm 350mA 2.85Vf 5000K 115° Everlight - Everlight 45-21 Series Surface Mount LEDs 45-21/QK2C-B2832AC2CB2/2T - Warm White 2000mcd 20mA 3.25Vf 3050K 120° 45-21/LK2C-B38452C4CB2/2T - Nuetral White 2000mcd 20mA 3.25Vf 4150K 120° 45-21/LK2C-B50634C6CB2/2T - Cold White 2200mcd 20mA 3.25Vf 5650K 120° PLCC2 Reverse Mount LS T77K-J1L2-1-0-2-R18-Z - Red 11.25mcd 2mA 1.8Vf 630nm 120° LO T77K-L1M2-24-Z - Orange 19.6mcd 2mA 1.8Vf 606nm 120° LY T77K-K2M1-26-Z - Yellow 15.7mcd 2mA 1.8Vf 587nm 120°
R1-R4 R6-R10 R12 R13 R17 = SparkFun-Resistors:1KOHM: 1kΩ resistor A resistor is a passive two-terminal electrical component that implements electrical resistance as a circuit element. Resistors act to reduce current flow, and, at the same time, act to lower voltage levels within circuits. - Wikipedia; PROD_ID: RES-07856; VALUE: 1k
R5 R15 = microbuilder:RESISTOR: Resistors For new designs, use the packages preceded by an '_' character since they are more reliable: The following footprints should be used on most boards: _0402 - Standard footprint for regular board layouts _0603 - Standard footprint for regular board layouts _0805 - Standard footprint for regular board layouts _1206 - Standard footprint for regular board layouts For extremely tight-pitch boards where space is at a premium, the following 'micro-pitch' footprints can be used (smaller pads, no silkscreen outline, etc.): _0402MP - Micro-pitch footprint for very dense/compact boards _0603MP - Micro-pitch footprint for very dense/compact boards _0805MP - Micro-pitch footprint for very dense/compact boards _1206MP - Micro-pitch footprint for very dense/compact boards
R11 R14 R16 R20 = SparkFun-Resistors:1KOHM: 1kΩ resistor A resistor is a passive two-terminal electrical component that implements electrical resistance as a circuit element. Resistors act to reduce current flow, and, at the same time, act to lower voltage levels within circuits. - Wikipedia; PROD_ID: RES-07856
SJ1 SJ2 = SparkFun-Retired:SOLDERJUMPER: Solder Jumper Standard SMD solder jumper. Used to automate production. Two varients : Normally Open and Normally Closed are the same, but have different paste layers. NC will have a large amount of paste and should jumper during reflow.
SW1 = adafruit:SPST_TACT: SMT 6mm switch, EVQQ2 series http://www.ladyada.net/library/eagle
T1 = transistor:*-PNP_DRIVER-: PNP Bias Resistor Transistor
TAG-CONNECT = MF_Connectors:CON_02X05: Library: MF_Connectors Description: Header Connector with 10 Positions and 02 Rows. Use the LABEL Attribute to label the pin on the schematic and PCB. You can remove the attributes on the PCB by using the SMASH function on the part and then deleting the text.; HOUSEPART: NO; MPN: TC2050-IDC-NL; POPULATE: 0; URL: http://www.tag-connect.com/Materials/TC2050-IDC-NL%20Datasheet.pdf
TP1-TP9 TP12-TP17 = testpad:TP: Test pad
U2 = microbuilder:VREG_TPS6103X: TPS6103x 4A Boost - 1.8-5.5V Input, Adjustable Output to 5.5V
U3 = microbuilder:MCP73871: MCP73871 Lithium Polymer Battery Charger Digikey: MCP73871-2CCI/ML-ND
U4 = microbuilder:FAN5331: FAN5331 - LED/OLED 20V Boost Converter Digikey: FAN5331SXCT-ND
U5 = FPC:TPD3E001SOT5
U6 = SparkFun-IC-Comms:MAX2323: RS232 Transceiver This part covers 232 drivers that are compatible with the MAX3232. Sipex SP3232EB Datasheet <http://cdn.sparkfun.com/datasheets/Components/General%20IC/SP3232EBCA-L.pdf> SparkFun Products SOIC component <https://www.sparkfun.com/products/589> (COM-00589 / IC-08171) Retired DIP component (COM-00316 / IC-08446) SparkFun Transceiver Breakout - MAX3232 <https://www.sparkfun.com/products/11189> (BOB-11189) SparkFun XBee Explorer Serial <https://www.sparkfun.com/products/13225> (WRL-13225); PROD_ID: IC-08171
U$5 = FPC:OS102011MA1QN1
U$30 = FPC:SAMTEC_PI_REVERSE
USB = USBC:TYPE-C-31-M-12
VREG = burr-brown:REG1117: 800mA and 1A Low Dropout (LDO) Positive Regulator 1.8V, 2.5V, 2.85V, 3.3V, 5V, and Adj; MPN: REG1117; OC_FARNELL: 1097566; OC_NEWARK: 14P6981
X1 = adafruit2:XTAL: Low cost SMT crystals, no capacitors included http://www.ladyada.net/library/eagle
X2 = con-leotronics:1365-10: DUAL ROW STRAIGHT HEADER 1364 SERIES. 1.27mm x 1.27mm. Without Fixing Post. SMT Source: http://www.leotronics.co.uk/Conexcon/Data%20Sheets/sec.%20A/1364ing.pdf; OC_FARNELL: unknown; OC_NEWARK: unknown

## Net classes
1 diff_pairs: width 0.254 mm, clearance 0.102 mm